# Altium project altium_no_connect.PrjPcb
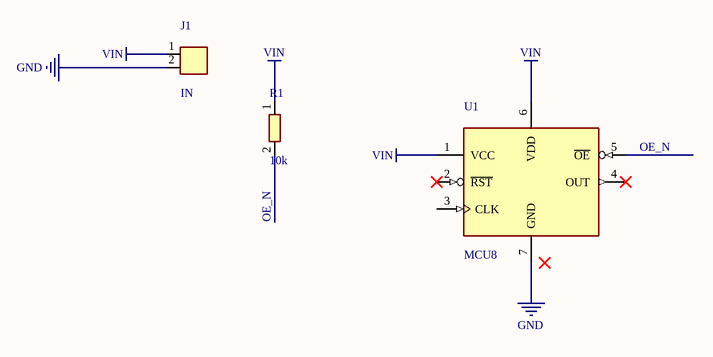
[diagram p0: altium_no_connect.SchDoc]
1 sheet, 3 parts. Net scope: global (net labels, ports and power ports of the same name join across sheets).

## Sheet altium_no_connect.SchDoc
size A4

### Parts
J1  IN  [PinHeader_1x02]
R1  10k  [R0603]
U1  MCU8  [SOIC8]

### Nets
GND: J1.2 U1.7(GND)
VIN: J1.1 R1.1 U1.1(VCC) U1.6(VDD)
OE_N: R1.2 U1.5(~{OE})

Not connected (* = marked no-connect by the designer): U1 2(~{RST})* 3(CLK) 4(OUT)* 8(TP)

### Library data of the parts
J1 = CONN2
R1 = R_V